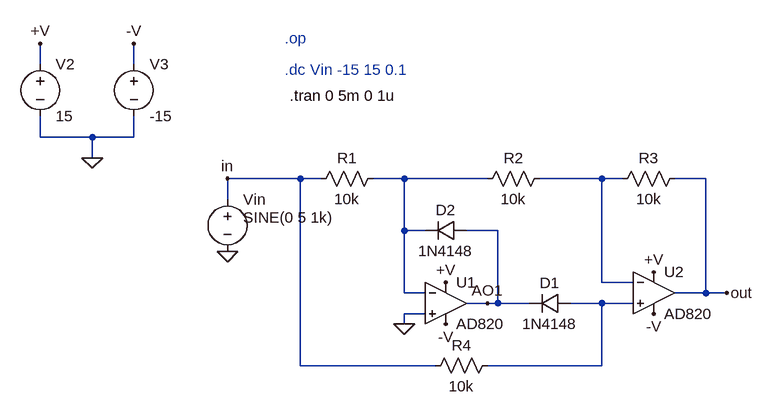
[diagram p0: schematic Redresor_bialternanta.asc]
Redresor_bialternanta.asc, the LTspice schematic file:
Version 4.1
SHEET 1 880 680
WIRE -480 -192 -480 -224
WIRE -336 -192 -336 -224
WIRE -480 -80 -480 -112
WIRE -400 -80 -480 -80
WIRE -336 -80 -336 -112
WIRE -336 -80 -400 -80
WIRE -400 -48 -400 -80
WIRE -80 -16 -192 -16
WIRE -48 -16 -80 -16
WIRE 80 -16 32 -16
WIRE 208 -16 80 -16
WIRE 384 -16 288 -16
WIRE 416 -16 384 -16
WIRE 544 -16 496 -16
WIRE -192 16 -192 -16
WIRE 80 64 80 -16
WIRE 112 64 80 64
WIRE 224 64 176 64
WIRE 384 144 384 -16
WIRE 432 144 384 144
WIRE 80 160 80 64
WIRE 112 160 80 160
WIRE 544 160 544 -16
WIRE 544 160 496 160
WIRE 576 160 544 160
WIRE 208 176 176 176
WIRE 224 176 224 64
WIRE 224 176 208 176
WIRE 272 176 224 176
WIRE 384 176 336 176
WIRE 432 176 384 176
WIRE 112 192 80 192
WIRE 80 208 80 192
WIRE -80 272 -80 -16
WIRE 128 272 -80 272
WIRE 384 272 384 176
WIRE 384 272 208 272
FLAG -192 96 0
FLAG 576 160 out
FLAG 80 208 0
FLAG -400 -48 0
FLAG -480 -224 +V
FLAG 144 144 +V
FLAG 464 128 +V
FLAG -336 -224 -V
FLAG 144 208 -V
FLAG 464 192 -V
FLAG -192 -16 in
FLAG 208 176 AO1
SYMBOL OpAmps\\AD820 144 112 R0
SYMATTR InstName U1
SYMBOL OpAmps\\AD820 464 96 R0
SYMATTR InstName U2
SYMBOL diode 336 160 R90
WINDOW 0 0 32 VBottom 2
WINDOW 3 32 32 VTop 2
SYMATTR InstName D1
SYMATTR Value 1N4148
SYMBOL diode 176 80 M270
WINDOW 0 32 32 VTop 2
WINDOW 3 0 32 VBottom 2
SYMATTR InstName D2
SYMATTR Value 1N4148
SYMBOL res 48 -32 R90
WINDOW 0 0 56 VBottom 2
WINDOW 3 32 56 VTop 2
SYMATTR InstName R1
SYMATTR Value 10k
SYMBOL res 224 256 R90
WINDOW 0 0 56 VBottom 2
WINDOW 3 32 56 VTop 2
SYMATTR InstName R4
SYMATTR Value 10k
SYMBOL res 304 -32 R90
WINDOW 0 0 56 VBottom 2
WINDOW 3 32 56 VTop 2
SYMATTR InstName R2
SYMATTR Value 10k
SYMBOL res 512 -32 R90
WINDOW 0 0 56 VBottom 2
WINDOW 3 32 56 VTop 2
SYMATTR InstName R3
SYMATTR Value 10k
SYMBOL voltage -192 0 R0
WINDOW 3 24 44 Left 2
WINDOW 123 24 124 Left 2
WINDOW 39 0 0 Left 0
SYMATTR Value SINE(0 5 1k)
SYMATTR InstName Vin
SYMBOL voltage -480 -208 R0
WINDOW 123 0 0 Left 0
WINDOW 39 0 0 Left 0
SYMATTR InstName V2
SYMATTR Value 15
SYMBOL voltage -336 -208 R0
WINDOW 123 0 0 Left 0
WINDOW 39 0 0 Left 0
SYMATTR InstName V3
SYMATTR Value -15
TEXT -104 -232 Left 2 ;.op
TEXT -104 -184 Left 2 ;.dc Vin -15 15 0.1
TEXT -96 -144 Left 2 !.tran 0 5m 0 1u

The netlist it stands for:
* Redresor_bialternanta.asc
X§U1 0 N001 +V -V AO1 AD820  ; pins In+ In- V+ V- OUT
X§U2 N003 N002 +V -V out AD820  ; pins In+ In- V+ V- OUT
D1 N003 AO1 1N4148
D2 AO1 N001 1N4148
R1 N001 in 10k
R4 N003 in 10k
R2 N002 N001 10k
R3 out N002 10k
Vin in 0 SINE(0 5 1k)
V2 +V 0 15
V3 -V 0 -15
.model D D
.lib standard.dio
* .op
* .dc Vin -15 15 0.1
.tran 0 5m 0 1u
.backanno
.end